# Altium project respi.PrjPcb
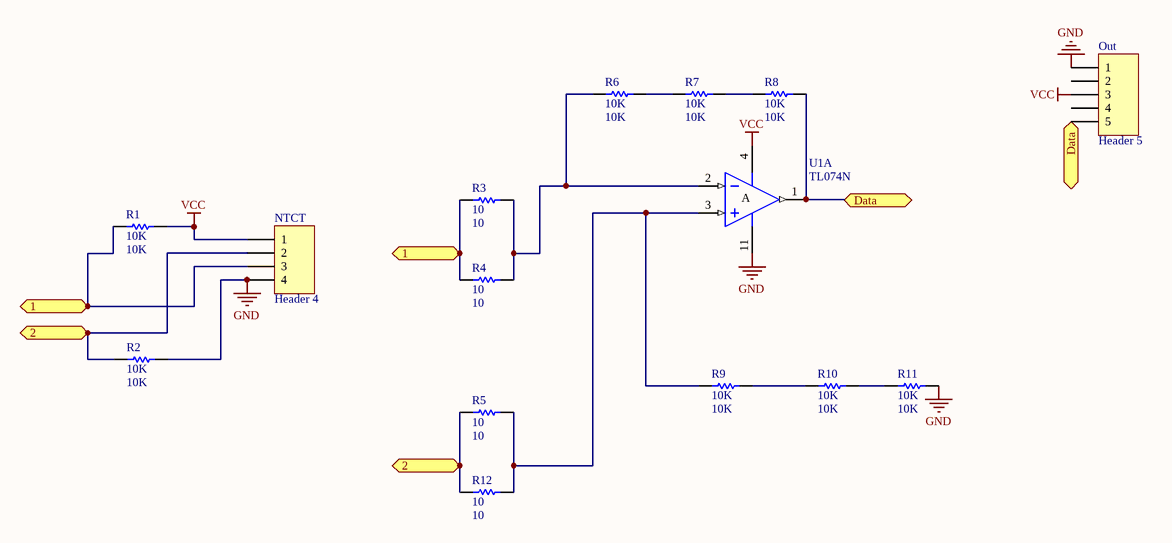
[diagram p0: respi.SchDoc]
1 sheet, 15 parts. Net scope: flat (ports and power ports of the same name join across sheets).
Board file: respi.PcbDoc

## Sheet respi.SchDoc
size A4

### Parts
NTCT  Header 4  [HDR1X4]
Out  Header 5  [HDR1X5]
R1  10K  [AXIAL-0.3]
R2  10K  [AXIAL-0.3]
R3  10  [AXIAL-0.3]
R4  10  [AXIAL-0.3]
R5  10  [AXIAL-0.3]
R6  10K  [AXIAL-0.3]
R7  10K  [AXIAL-0.3]
R8  10K  [AXIAL-0.3]
R9  10K  [AXIAL-0.3]
R10  10K  [AXIAL-0.3]
R11  10K  [AXIAL-0.3]
R12  10  [AXIAL-0.3]
U1  TL074N  [N014]  (part A of 4)

### Ports
1, 2, Data

### Nets
GND: NTCT.4 Out.1 R2.2 R11.2 U1.11(V-)
VCC: NTCT.1 Out.3 R1.2 U1.4(V+)
NetNTCT_2: NTCT.2 R2.1 R5.1 R12.1 ; port 2
NetNTCT_3: NTCT.3 R1.1 R3.1 R4.1 ; port 1
NetOut_5: Out.5 R8.2 U1.1(OUT) ; port Data
NetR3_2: R3.2 R4.2 R6.1 U1.2(IN-)
NetR5_2: R5.2 R9.1 R12.2 U1.3(IN+)
NetR6_2: R6.2 R7.1
NetR7_2: R7.2 R8.1
NetR9_2: R9.2 R10.1
NetR10_2: R10.2 R11.1

Not connected (* = marked no-connect by the designer): Out 2 4

### Notes on the sheet
- (in symbol TL074N, part A) A

### Library data of the parts
NTCT = Header 4: Header, 4-Pin; LatestRevisionDate: 17-Jul-2002; LatestRevisionNote: Re-released for DXP Platform.; Publisher: Altium Limited
Out = Header 5: Header, 5-Pin; LatestRevisionDate: 17-Jul-2002; LatestRevisionNote: Re-released for DXP Platform.; Publisher: Altium Limited
R1-R12 = Res1: Resistor; Published: 8-Jun-2000; LatestRevisionDate: 17-Jul-2002; LatestRevisionNote: Re-released for DXP Platform.; PackageReference: AXIAL-0.3; Publisher: Altium Limited; PackageDescription: Axial Device, Thru-Hole; 2 Leads; 0.3 in Pin Spacing
  R1 R2 R6-R11: Value: 10K
  R3-R5 R12: Value: 10
U1 = TL074N: Low-Noise JFET-Input Operational Amplifier; Published: 16-Jan-2001; LatestRevisionDate: 04-Mar-2005; LatestRevisionNote: Stylized 3D Model Added.; DatasheetVersion: Aug-1996; PackageVersion: Oct-1995; PackageReference: N014; Publisher: Altium Limited; PackageDescription: DIP; 14 Leads; Row Spacing 7.62 mm; Pitch 2.54 mm; ComponentLink1Description: Manufacturer Link; ComponentLink1URL: http://www.ti.com/; ComponentLink2Description: Datasheet; ComponentLink2URL: http://www-s.ti.com/sc/ds/tl074.pdf